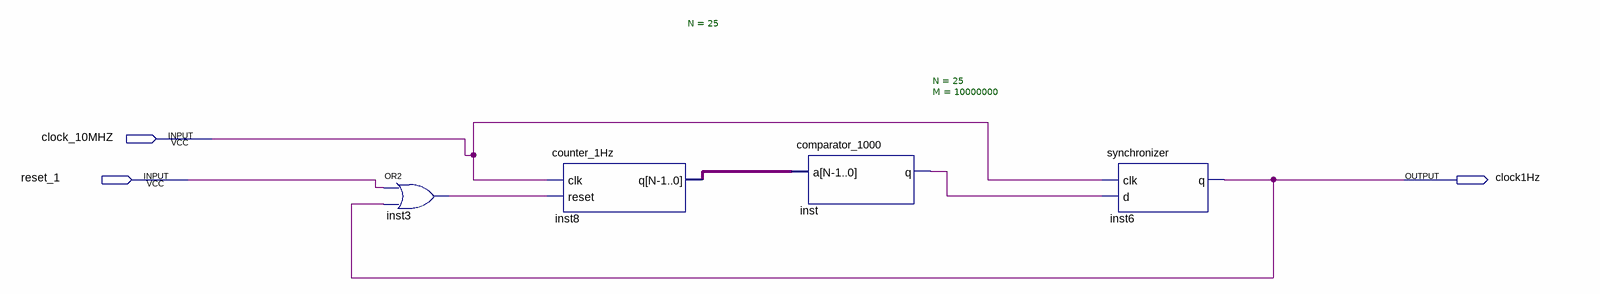
[diagram p0: schematic sheet]
// Quartus schematic slower.bdf as structural Verilog: 4 symbols, 3 pins
module slower (
  input  clock_10MHZ,
  input  reset_1,
  output clock1Hz
);

  wire inst3_out, inst_q;
  wire [24:0] inst8_q;

  or inst3 (inst3_out, reset_1, clock1Hz);
  counter_1Hz #(.N(25)) inst8 (.clk(clock_10MHZ), .reset(inst3_out), .q(inst8_q));
  comparator_1000 #(.N(25), .M(10000000)) inst (.a(inst8_q), .q(inst_q));
  synchronizer inst6 (.clk(clock_10MHZ), .d(inst_q), .q(clock1Hz));
endmodule
